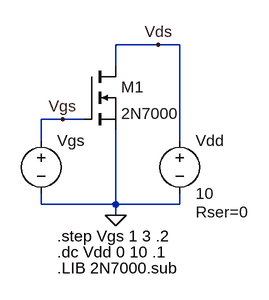
[diagram p0: schematic PreLab1.asc]
PreLab1.asc, the LTspice schematic file:
Version 4
SHEET 1 880 680
WIRE 304 -64 240 -64
WIRE 336 -64 304 -64
WIRE 240 -32 240 -64
WIRE 160 48 128 48
WIRE 192 48 160 48
WIRE 128 80 128 48
WIRE 336 80 336 -64
WIRE 128 176 128 160
WIRE 240 176 240 64
WIRE 240 176 128 176
WIRE 336 176 336 160
WIRE 336 176 240 176
WIRE 240 192 240 176
FLAG 240 192 0
FLAG 304 -64 Vds
FLAG 160 48 Vgs
SYMBOL voltage 128 64 R0
WINDOW 3 24 44 Left 2
WINDOW 123 0 0 Left 0
WINDOW 39 0 0 Left 0
SYMATTR InstName Vgs
SYMATTR Value ""
SYMBOL voltage 336 64 R0
WINDOW 123 0 0 Left 0
WINDOW 39 24 124 Left 2
SYMATTR InstName Vdd
SYMATTR Value 10
SYMATTR SpiceLine Rser=0
SYMBOL nmos 192 -32 R0
SYMATTR InstName M1
SYMATTR Value 2N7000
TEXT 152 224 Left 2 !.step Vgs 1 3 .2
TEXT 152 248 Left 2 !.dc Vdd 0 10 .1
TEXT 152 272 Left 2 !.LIB 2N7000.sub

The netlist it stands for:
* PreLab1.asc
Vgs Vgs 0
Vdd Vds 0 10 Rser=0
M1 Vds Vgs 0 0 2N7000
.model NMOS NMOS
.model PMOS PMOS
.lib standard.mos
.step Vgs 1 3 .2
.dc Vdd 0 10 .1
.LIB 2N7000.sub
.backanno
.end